# Altium project 电源板.PrjPCB
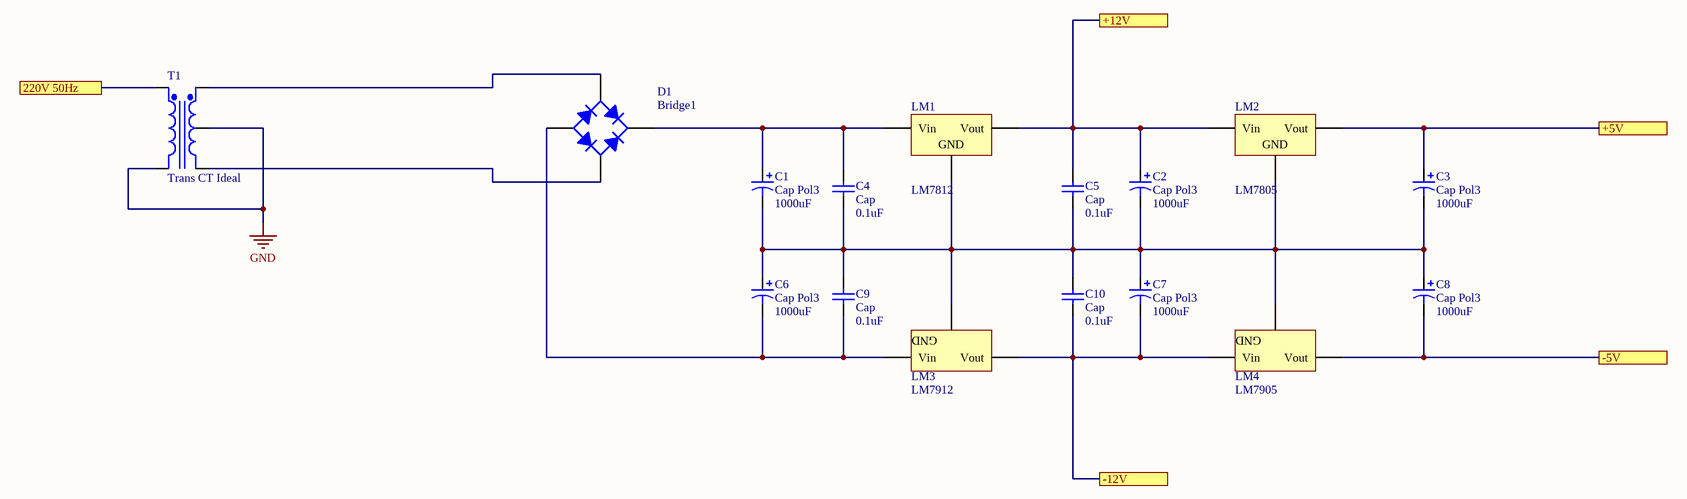
[diagram p0: 电源板原理图.SchDoc]
1 sheet, 16 parts. Net scope: flat (ports and power ports of the same name join across sheets).
Board file: 电源板PCB.PcbDoc

## Sheet 电源板原理图.SchDoc
size A1; Organization: Protel International P/L; Address1: L3, 12a Rodborough Rd; Address2: Frenchs Forest; Address3: NSW; Address4: Australia 2086

### Parts
C1  Cap Pol3  value 1000uF  [1812]
C2  Cap Pol3  value 1000uF  [1812]
C3  Cap Pol3  value 1000uF  [1812]
C4  Cap  value 0.1uF  [RAD-0.3]
C5  Cap  value 0.1uF  [RAD-0.3]
C6  Cap Pol3  value 1000uF  [1812]
C7  Cap Pol3  value 1000uF  [1812]
C8  Cap Pol3  value 1000uF  [1812]
C9  Cap  value 0.1uF  [RAD-0.3]
C10  Cap  value 0.1uF  [RAD-0.3]
D1  Bridge1  [D-38]
LM1  LM7812  [D2PAK_L]
LM2  LM7805  [D2PAK_L]
LM3  LM7912  [D2PAK_L]
LM4  LM7905  [D2PAK_L]
T1  Trans CT Ideal  [TRF_5]

### Ports
220V 50Hz, +5V, +12V, -5V, -12V

### Nets
GND: T1.2(Pri-) T1.4(SecCT)
NetC1_1: C1.1 C4.2 D1.1(K) LM1.1(Vin)
NetC1_2: C1.2 C2.2 C3.2 C4.1 C5.1 C6.1 C7.1 C8.1 C9.2 C10.2 LM1.2(GND) LM2.2(GND) LM3.2(GND) LM4.2(GND)
NetC2_1: C2.1 C5.2 LM1.3(Vout) LM2.1(Vin) ; port +12V
NetC3_1: C3.1 LM2.3(Vout) ; port +5V
NetC6_2: C6.2 C9.1 D1.3(A) LM3.1(Vin)
NetC7_2: C7.2 C10.1 LM3.3(Vout) LM4.1(Vin) ; port -12V
NetC8_2: C8.2 LM4.3(Vout) ; port -5V
NetD1_2: D1.2(C) T1.5(Sec-)
NetD1_4: D1.4(C) T1.3(Sec+)
NetT1_1: T1.1(Pri+) ; port 220V 50Hz

### Notes on the sheet
- Title
- Size:
- Date:
- File:
- A1
- Number:
- Time:
- Revision:
- Sheet
- of

### Library data of the parts
C1-C3 C6-C8 = Cap Pol3: Polarized Capacitor (Surface Mount); Published: 8-Jun-2000; LatestRevisionDate: 29-May-2009; LatestRevisionNote: IPC-7351 Footprint Added.; PackageReference: C0805; Publisher: Altium Limited; PackageDescription: Chip Capacitor
C4 C5 C9 C10 = Cap: Capacitor; Published: 8-Jun-2000; LatestRevisionDate: 17-Jul-2002; LatestRevisionNote: Re-released for DXP Platform.; PackageReference: RAD-0.3; Publisher: Altium Limited; PackageDescription: Radial Cap, Thru-Hole; 2 Leads; 0.3 in Pin Spacing
D1 = Bridge1: Full Wave Diode Bridge; Published: 8-Jun-2000; LatestRevisionDate: 29-May-2009; LatestRevisionNote: Sch pins A & K swapped.; DatasheetVersion: E2732B; PackageReference: D-38; Publisher: Altium Limited; PackageDescription: Bridge Rectifier; 4 Terminals; Body 9.4 x 9.4 mm (typ); Pitch 5.08 mm
LM1-LM4 = Volt Reg: Voltage Regulator; Published: 24-Mar-1999; LatestRevisionDate: 29-May-2009; LatestRevisionNote: IPC-7351 Footprint Added.; PackageReference: D2PAK; Publisher: Altium Limited; PackageDescription: 3-Pin Transistor Outline Package 2.54 mm Pitch, 15.1 mm Lead Span
T1 = Trans CT Ideal: Center-Tapped Transformer (Ideal); Published: 8-Jun-2000; LatestRevisionDate: 17-Jul-2002; LatestRevisionNote: Re-released for DXP Platform.; PackageReference: TRF_5; Publisher: Altium Limited; PackageDescription: Transformer; 5 Leads